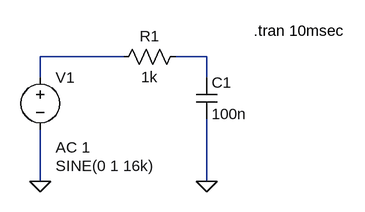
[diagram p0: schematic EP2.asc]
EP2.asc, the LTspice schematic file:
Version 4.1
SHEET 1 880 680
WIRE 144 304 16 304
WIRE 272 304 224 304
WIRE 16 336 16 304
WIRE 272 336 272 304
WIRE 16 496 16 416
WIRE 272 496 272 400
FLAG 272 496 0
FLAG 16 496 0
SYMBOL voltage 16 320 R0
WINDOW 3 24 152 Left 2
WINDOW 123 24 124 Left 2
WINDOW 39 0 0 Left 0
SYMATTR InstName V1
SYMATTR Value SINE(0 1 16k)
SYMATTR Value2 AC 1
SYMBOL res 240 288 R90
WINDOW 0 0 56 VBottom 2
WINDOW 3 32 56 VTop 2
SYMATTR InstName R1
SYMATTR Value 1k
SYMBOL cap 256 336 R0
SYMATTR InstName C1
SYMATTR Value 100n
TEXT 344 264 Left 2 !.tran 10msec

The netlist it stands for:
* EP2.asc
V1 N001 0 SINE(0 1 16k) AC 1
R1 N002 N001 1k
C1 N002 0 100n
.tran 10msec
.backanno
.end